# EAGLE schematic Sch pengusir hama pcb (EAGLE 9.6.0)
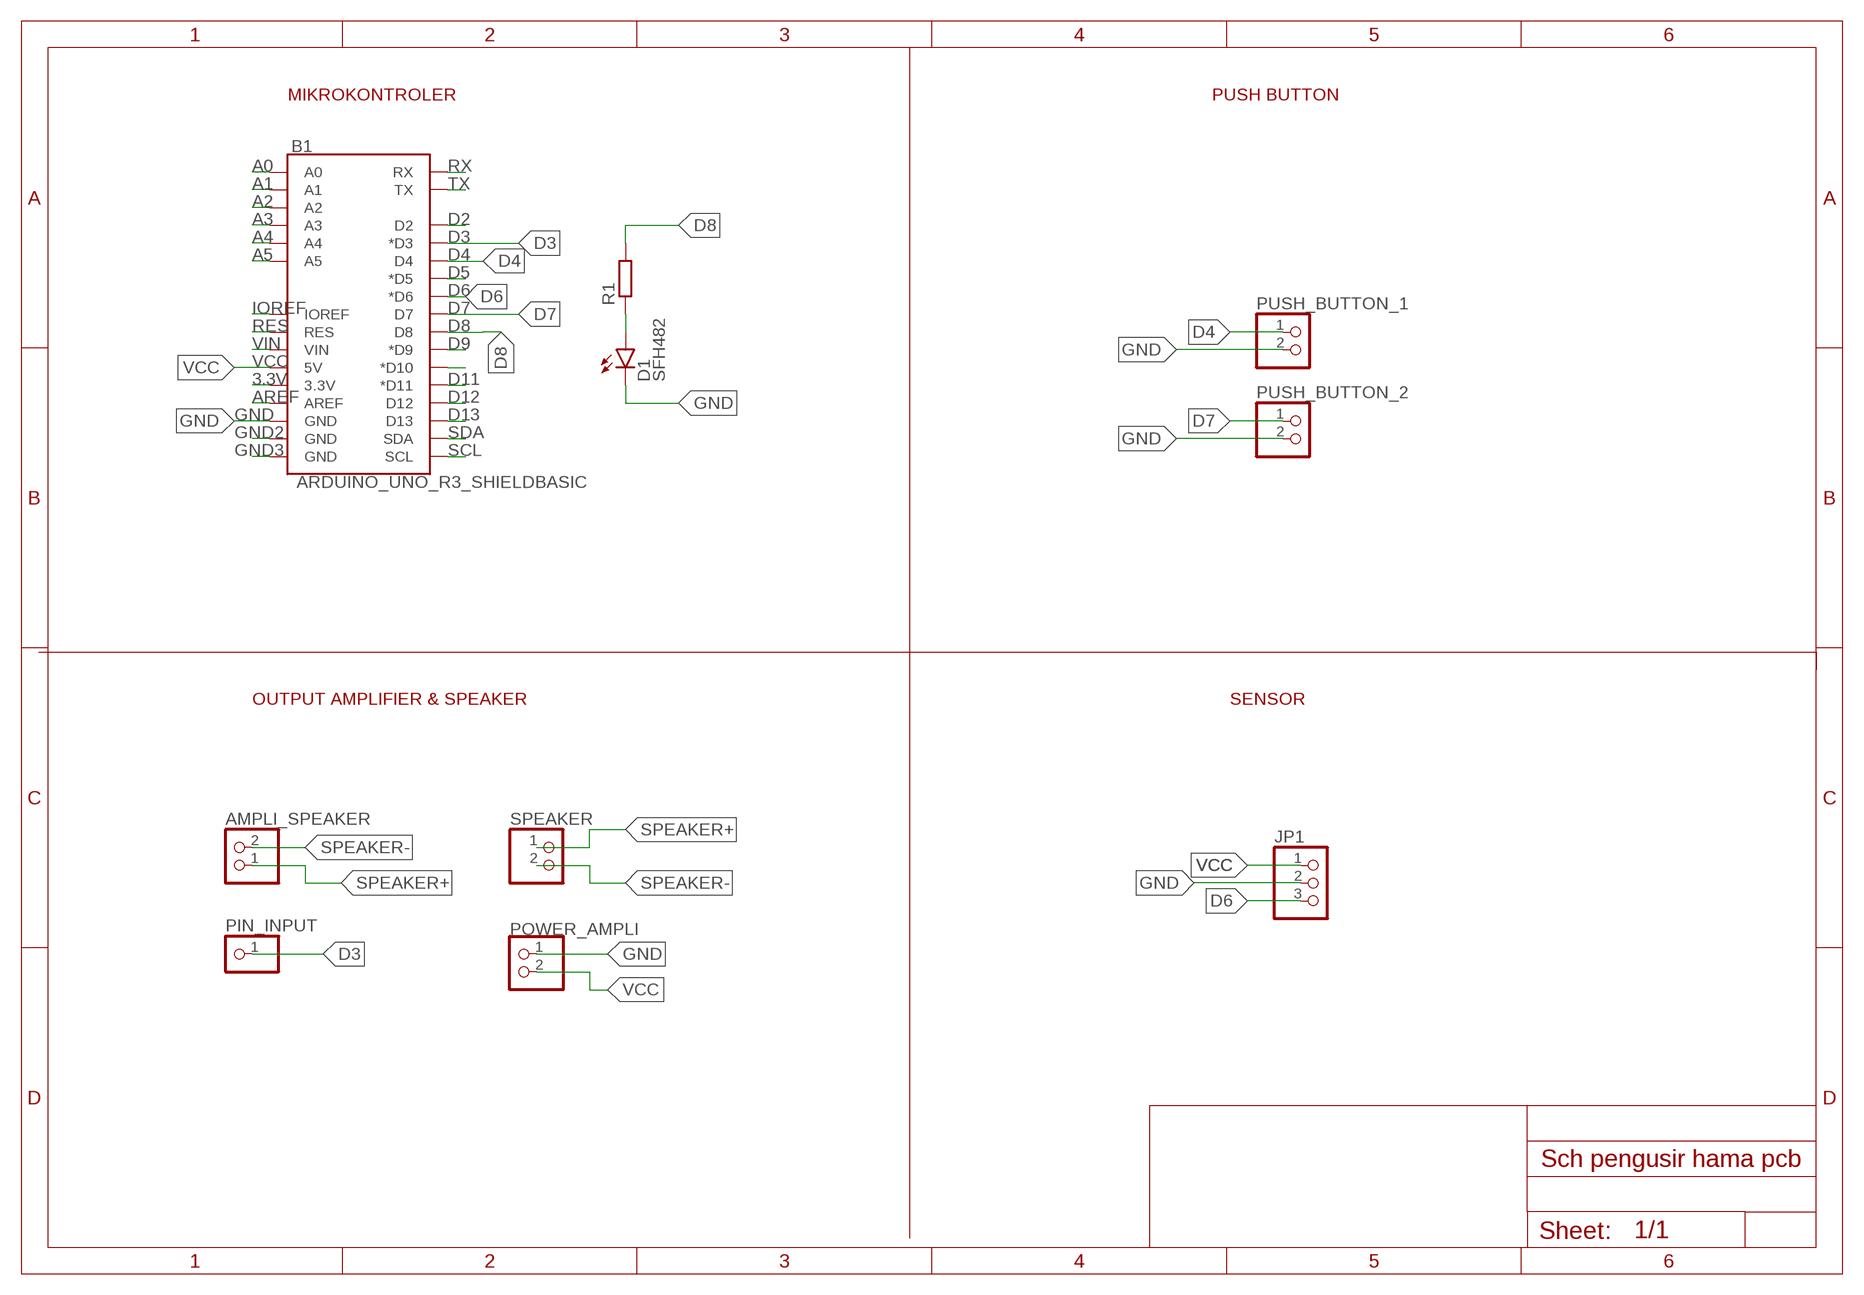
[diagram p0: schematic, sheet 1]

## Parts
AMPLI_SPEAKER  PINHD-1X2  [1X02]
B1  ARDUINO_UNO_R3_SHIELDBASIC  [UNO_R3_SHIELD]
D1  SFH482  [SFH482]
JP1  PINHD-1X3  [1X03]
PIN_INPUT  PINHD-1X1  [1X01]
POWER_AMPLI  PINHD-1X2  [1X02]
PUSH_BUTTON_1  PINHD-1X2  [1X02]
PUSH_BUTTON_2  PINHD-1X2  [1X02]
R1  R-EU_0207/7  [0207/7]
SPEAKER  PINHD-1X2  [1X02]

## Nets
3.3V: B1.3.3V
A0: B1.A0
A1: B1.A1
A2: B1.A2
A3: B1.A3
A4: B1.A4
A5: B1.A5
AREF: B1.AREF
D2: B1.D2
D3: B1.D3(*D3) PIN_INPUT.1
D4: B1.D4 PUSH_BUTTON_1.1
D5: B1.D5(*D5)
D6: B1.D6(*D6) JP1.3
D7: B1.D7 PUSH_BUTTON_2.1
D8: B1.D8 R1.2
D9: B1.D9(*D9)
D10: B1.D10(*D10)
D11: B1.D11(*D11)
D12: B1.D12
D13: B1.D13
GND: B1.GND@2(GND) D1.K(C) JP1.2 POWER_AMPLI.1 PUSH_BUTTON_1.2 PUSH_BUTTON_2.2
GND2: B1.GND@1(GND)
GND3: B1.GND@0(GND)
IOREF: B1.IOREF
N$1: D1.A R1.1
RES: B1.RES
RX: B1.RX
SCL: B1.SCL
SDA: B1.SDA
SPEAKER+: AMPLI_SPEAKER.1 SPEAKER.1
SPEAKER-: AMPLI_SPEAKER.2 SPEAKER.2
TX: B1.TX
VCC: B1.5V JP1.1 POWER_AMPLI.2
VIN: B1.VIN

## Notes on the sheet
- MIKROKONTROLER | PUSH BUTTON
- OUTPUT AMPLIFIER & SPEAKER | SENSOR

## Library data of the parts
AMPLI_SPEAKER POWER_AMPLI PUSH_BUTTON_1 PUSH_BUTTON_2 SPEAKER = pinhead:PINHD-1X2: PIN HEADER
B1 = SparkFun-Boards:ARDUINO_UNO_R3_SHIELD: Arduino R3 Shield Footprint Shield form compatible with the Arduino Uno R3. SparkFun Products: MG2639 Cellular Shield <https://www.sparkfun.com/products/13120> MIDI Shield <https://www.sparkfun.com/products/12898> R3 Stackable Headers Kit <https://www.sparkfun.com/products/11417>
D1 = led:SFH482: IR LED infrared emitting diode, Infineon
JP1 = pinhead:PINHD-1X3: PIN HEADER
PIN_INPUT = pinhead:PINHD-1X1: PIN HEADER
R1 = rcl:R-EU_: RESISTOR, European symbol; SPICEPREFIX: R